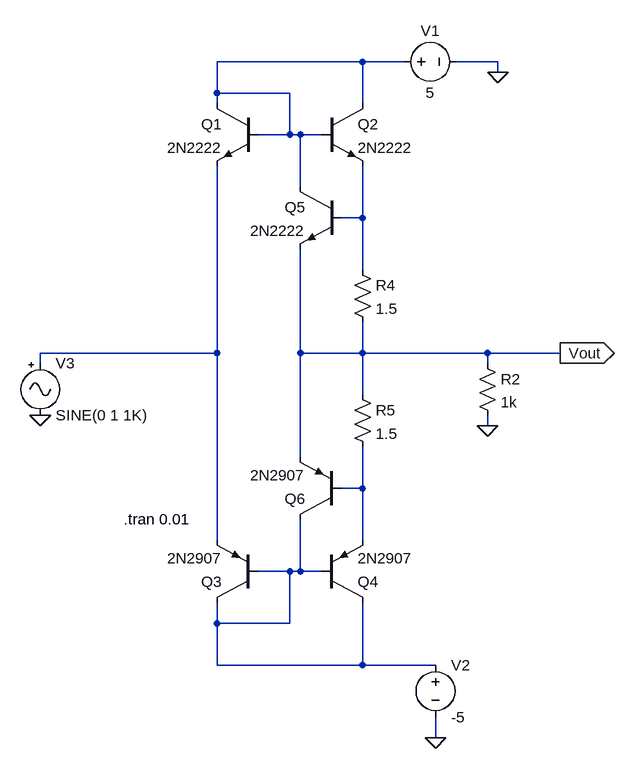
[diagram p0: schematic block3.asc]
block3.asc, the LTspice schematic file:
Version 4
SHEET 1 880 912
WIRE 288 -144 64 -144
WIRE 352 -144 288 -144
WIRE 496 -144 432 -144
WIRE 496 -128 496 -144
WIRE 64 -96 64 -144
WIRE 176 -96 64 -96
WIRE 64 -80 64 -96
WIRE 288 -80 288 -144
WIRE 176 -32 176 -96
WIRE 176 -32 128 -32
WIRE 192 -32 176 -32
WIRE 224 -32 192 -32
WIRE 192 48 192 -32
WIRE 288 96 288 16
WIRE 288 96 256 96
WIRE 288 176 288 96
WIRE 64 304 64 16
WIRE 64 304 -208 304
WIRE 192 304 192 144
WIRE 288 304 288 256
WIRE 288 304 192 304
WIRE 480 304 288 304
WIRE 592 304 480 304
WIRE -208 320 -208 304
WIRE 480 320 480 304
WIRE 288 368 288 304
WIRE 480 416 480 400
WIRE 192 464 192 304
WIRE 288 512 288 448
WIRE 288 512 256 512
WIRE 64 592 64 304
WIRE 288 592 288 512
WIRE 176 640 128 640
WIRE 192 640 192 560
WIRE 192 640 176 640
WIRE 224 640 192 640
WIRE 64 720 64 688
WIRE 176 720 176 640
WIRE 176 720 64 720
WIRE 64 784 64 720
WIRE 288 784 64 784
WIRE 288 784 288 688
WIRE 400 784 288 784
WIRE 400 896 400 864
FLAG 496 -128 0
FLAG 400 896 0
FLAG -208 400 0
FLAG 592 304 Vout
IOPIN 592 304 Out
FLAG 480 416 0
SYMBOL voltage 336 -144 R270
WINDOW 0 32 56 VTop 2
WINDOW 3 -32 56 VBottom 2
SYMATTR InstName V1
SYMATTR Value 5
SYMBOL npn 128 -80 M0
SYMATTR InstName Q1
SYMATTR Value 2N2222
SYMBOL npn 224 -80 R0
SYMATTR InstName Q2
SYMATTR Value 2N2222
SYMBOL pnp 128 688 R180
SYMATTR InstName Q3
SYMATTR Value 2N2907
SYMBOL pnp 224 688 M180
SYMATTR InstName Q4
SYMATTR Value 2N2907
SYMBOL voltage 400 768 R0
SYMATTR InstName V2
SYMATTR Value -5
SYMBOL Misc/signal -208 304 R0
SYMATTR InstName V3
SYMBOL npn 256 48 M0
SYMATTR InstName Q5
SYMATTR Value 2N2222
SYMBOL res 272 160 R0
SYMATTR InstName R4
SYMATTR Value 1.5
SYMBOL pnp 256 560 R180
SYMATTR InstName Q6
SYMATTR Value 2N2907
SYMBOL res 272 352 R0
SYMATTR InstName R5
SYMATTR Value 1.5
SYMBOL res 464 304 R0
SYMATTR InstName R2
SYMATTR Value 1k
TEXT -80 560 Left 2 !.tran 0.01

The netlist it stands for:
* block3.asc
V1 N001 0 5
Q1 N001 N001 N003 0 2N2222
Q2 N001 N001 N002 0 2N2222
Q3 N005 N005 N003 0 2N2907
Q4 N005 N005 N004 0 2N2907
V2 N005 0 -5
V3 N003 0 SINE(0 1 1K)
Q5 N001 N002 Vout 0 2N2222
R4 N002 Vout 1.5
Q6 N005 N004 Vout 0 2N2907
R5 Vout N004 1.5
R2 Vout 0 1k
.model NPN NPN
.model PNP PNP
.lib standard.bjt
.tran 0.01
.backanno
.end